# Altium schematic sheet Sheet1(Filter).SchDoc
size A; SheetNumber: 1; SheetTotal: 7
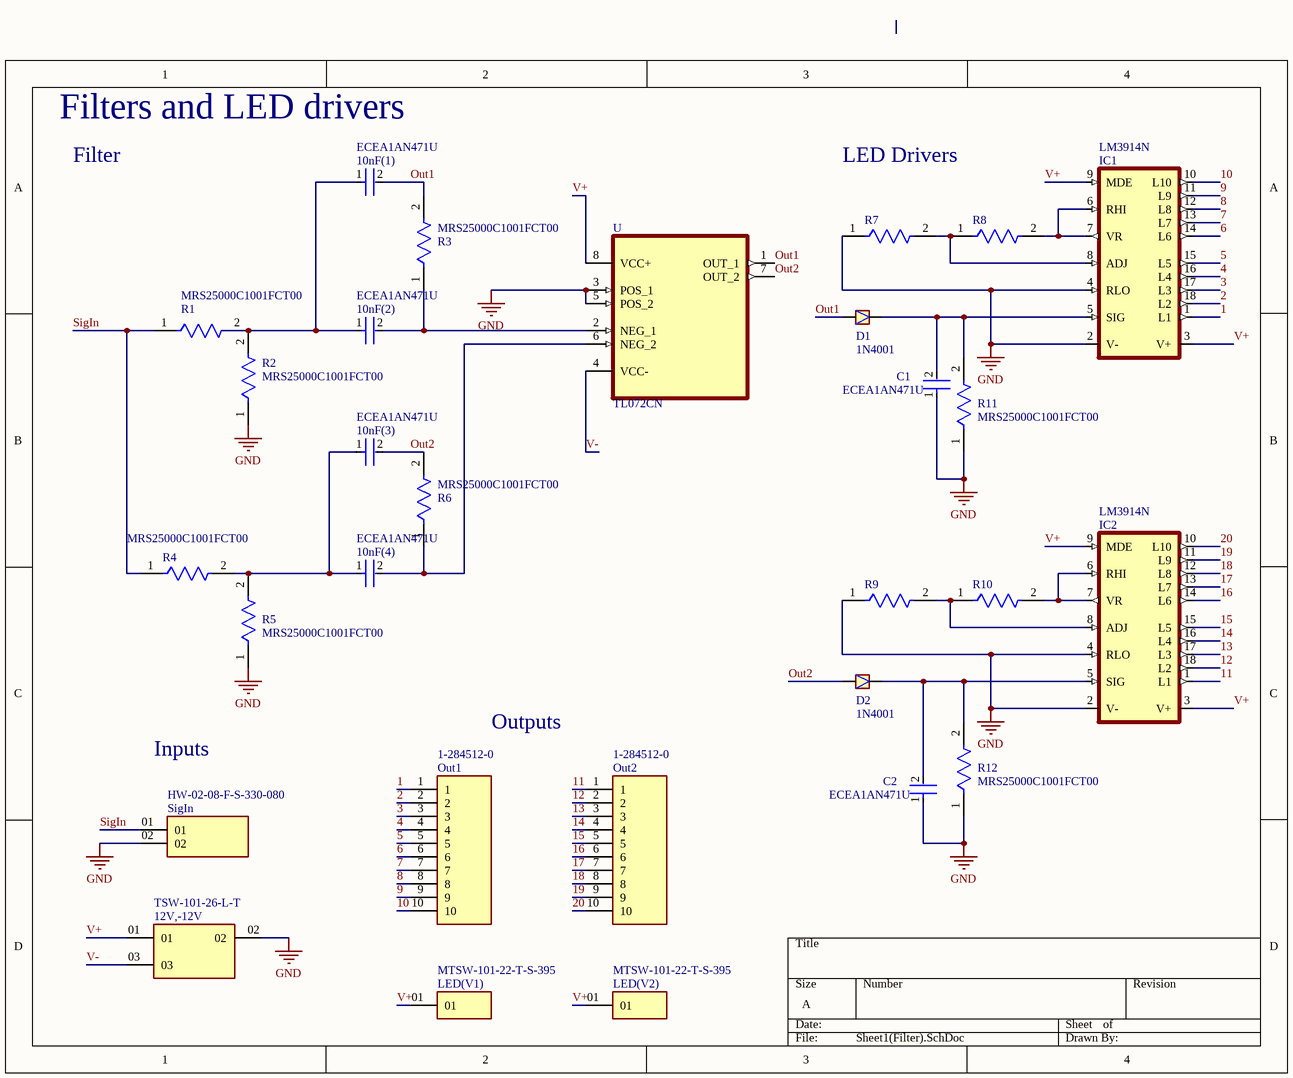
[diagram p0: Sheet1(Filter).SchDoc]

## Parts
10nF(1)  ECEA1AN471U  [FP-RAD-TH-D_10_0_5-L_16_1-MFG]
10nF(2)  ECEA1AN471U  [FP-RAD-TH-D_10_0_5-L_16_1-MFG]
10nF(3)  ECEA1AN471U  [FP-RAD-TH-D_10_0_5-L_16_1-MFG]
10nF(4)  ECEA1AN471U  [FP-RAD-TH-D_10_0_5-L_16_1-MFG]
12V,-12V  TSW-101-26-L-T  [SAMTEC_TSW-101-26-L-T]
C1  ECEA1AN471U  [FP-RAD-TH-D_10_0_5-L_16_1-MFG]
C2  ECEA1AN471U  [FP-RAD-TH-D_10_0_5-L_16_1-MFG]
D1  1N4001  [DO41-10]
D2  1N4001  [DO41-10]
IC1  LM3914N  [DIL18]
IC2  LM3914N  [DIL18]
LED(V1)  MTSW-101-22-T-S-395  [SAMTEC_MTSW-101-22-T-S-395]
LED(V2)  MTSW-101-22-T-S-395  [SAMTEC_MTSW-101-22-T-S-395]
Out1  1-284512-0  [TE_1-284512-0]
Out2  1-284512-0  [TE_1-284512-0]
R1  MRS25000C1001FCT00  [FP-MRS25-MFG]
R2  MRS25000C1001FCT00  [FP-MRS25-MFG]
R3  MRS25000C1001FCT00  [FP-MRS25-MFG]
R4  MRS25000C1001FCT00  [FP-MRS25-MFG]
R5  MRS25000C1001FCT00  [FP-MRS25-MFG]
R6  MRS25000C1001FCT00  [FP-MRS25-MFG]
R7  MRS25000C1001FCT00  [FP-MRS25-MFG]  (value not drawn)
R8  MRS25000C1001FCT00  [FP-MRS25-MFG]  (value not drawn)
R9  MRS25000C1001FCT00  [FP-MRS25-MFG]  (value not drawn)
R10  MRS25000C1001FCT00  [FP-MRS25-MFG]  (value not drawn)
R11  MRS25000C1001FCT00  [FP-MRS25-MFG]
R12  MRS25000C1001FCT00  [FP-MRS25-MFG]
SigIn  HW-02-08-F-S-330-080  [SAMTEC_HW-02-08-F-S-330-080]
U  TL072CN  [DIP254P762X533-8]

## Nets
GND: 12V,-12V.02 C1.1 C2.1 IC1.2(V-) IC1.4(RLO) IC2.2(V-) IC2.4(RLO) R2.1 R5.1 R7.1 R9.1 R11.1 R12.1 SigIn.02 U.3(POS_1) U.5(POS_2)
1: IC1.1(L1) Out1.1
2: IC1.18(L2) Out1.2
3: IC1.17(L3) Out1.3
4: IC1.16(L4) Out1.4
5: IC1.15(L5) Out1.5
6: IC1.14(L6) Out1.6
7: IC1.13(L7) Out1.7
8: IC1.12(L8) Out1.8
9: IC1.11(L9) Out1.9
10: IC1.10(L10) Out1.10
11: IC2.1(L1) Out2.1
12: IC2.18(L2) Out2.2
13: IC2.17(L3) Out2.3
14: IC2.16(L4) Out2.4
15: IC2.15(L5) Out2.5
16: IC2.14(L6) Out2.6
17: IC2.13(L7) Out2.7
18: IC2.12(L8) Out2.8
19: IC2.11(L9) Out2.9
20: IC2.10(L10) Out2.10
Out1: 10nF(1).2 D1.A(ANODE) R3.2 U.1(OUT_1)
Out2: 10nF(3).2 D2.A(ANODE) R6.2 U.7(OUT_2)
SigIn: R1.1 R4.1 SigIn.01
V+: 12V,-12V.01 IC1.3(V+) IC1.9(MDE) IC2.3(V+) IC2.9(MDE) LED(V1).01 LED(V2).01 U.8(VCC+)
V-: 12V,-12V.03 U.4(VCC-)
Net10nF(1)_1: 10nF(1).1 10nF(2).1 R1.2 R2.2
Net10nF(2)_2: 10nF(2).2 R3.1 U.2(NEG_1)
Net10nF(3)_1: 10nF(3).1 10nF(4).1 R4.2 R5.2
Net10nF(4)_2: 10nF(4).2 R6.1 U.6(NEG_2)
NetC1_2: C1.2 D1.C(CATHODE) IC1.5(SIG) R11.2
NetC2_2: C2.2 D2.C(CATHODE) IC2.5(SIG) R12.2
NetIC1_6: IC1.6(RHI) IC1.7(VR) R8.2
NetIC1_8: IC1.8(ADJ) R7.2 R8.1
NetIC2_6: IC2.6(RHI) IC2.7(VR) R10.2
NetIC2_8: IC2.8(ADJ) R9.2 R10.1

## Notes on the sheet
- Filters and LED drivers
- Filter
- LED Drivers
- Inputs
- Outputs

## Library data of the parts
10nF(1) 10nF(2) 10nF(3) 10nF(4) C1 C2 = CMP-05427-001928-1: Aluminum Electrolytic Capacitors (Radial Lead Type) 470uF ±20% 10V; Lead Diameter: 0.6mm; Dissipation Factor: 0.25%; Life (Hours): 2000Hour; Leakage Current: 3uA; Ripple Current: 340mA; Mount: Through Hole; REACH SVHC: No SVHC; Height: 16mm; Max Operating Temperature: 85°C; Case/Package: Radial; Packaging: Bulk; RoHS Compliant: Yes; Min Operating Temperature: -40°C; Termination: Radial; Height - Seated (Max): 0.63inch; Series: SU; Construction: RADIAL; Capacitance: 470uF; Tolerance: 20%; Radiation Hardening: No; Voltage Rating (DC): 10V; Lead Free: Lead Free; Diameter: 10mm; Lead Pitch: 5mm; Voltage Rating: 10V; Length: 16mm; Voltage: 10V; Package Quantity: 200
D1 D2 = 1N4001: <B>DIODE</B><p> general purpose rectifier, 1 A; MP: altium_native_batch; Package: None; Value: *; Availability: Unavailable; Price: None
IC1 IC2 = LM3914N: LED Lighting Drivers; MF: Texas Instruments; MP: LM3914N; Package: None; Price: None; Availability: Unavailable; Value: *; SnapEDA_Link: https://www.snapeda.com/parts/LM3914N/Texas%20Instruments/view-part/4652973/?ref=snap
LED(V1) LED(V2) = MTSW-101-22-T-S-395: Connector Header Through Hole 1 position; MF: Samtec; Package: None; Value: *; Check_prices: https://www.snapeda.com/parts/MTSW-101-22-T-S-395/Samtec/view-part/?ref=eda; SnapEDA_Link: https://www.snapeda.com/parts/MTSW-101-22-T-S-395/Samtec/view-part/?ref=snap; Availability: In Stock; Price: None; MP: MTSW-101-22-T-S-395; Purchase-URL: https://pricing.snapeda.com/search/part/MTSW-101-22-T-S-395/?ref=eda
Out1 Out2 = 1-284512-0: 10 POS TERMI-BLOK HDR 900 POLA; Number_of_Positions: 10; MF: TE Connectivity; Centerline_Pitch: 3.5 mm[.138 in]; Package: None; TE_purchase_URL: https://www.te.com/usa-en/product-1-284512-0.html?te_bu=Cor&te_type=disp&te_campaign=seda_glo_cor-seda-global-disp-prtnr-fy19-seda-model-bom-cta_sma-317_1&elqCampaignId=32493; Value: *; SnapEDA_Link: https://www.snapeda.com/parts/1-284512-0/TE%20Connectivity%20AMP%20Connectors/view-part/2366032/?ref=snap; Price: None; MP: 1-284512-0; Availability: Unavailable; EU_RoHS_Compliance: Compliant
R1-R12 = CMP-02408-000051-1: RES 1K OHM 0.6W 1% AXIAL; Power Rating: 600mW; Lead Diameter: 0.6mm; Voltage Rating (DC): 350V; Resistance: 1kR; Temperature Coefficient: 50ppm/°C; Width: 2.5mm; Military Standard: Not; Package Quantity: 5000; Radiation Hardening: No; Case/Package: Axial; Resistance Tolerance: 1%; Resistor Type: Metal Film; Contact Plating: Tin; Length: 6.5mm; Lead Free: Lead Free; RoHS Compliant: Yes; Mount: Through Hole; Number of Pins: 2; Technology: THIN FILM; Voltage Rating: 350V; Min Operating Temperature: -55°C; Weight: 0.00776oz; Diameter: 2.5mm; Construction: Cylindrical; Series: MRS25; Tolerance: 1%; Packaging: Tape and Reel; Max Operating Temperature: 155°C; Max Power Dissipation: 600mW; Number of Terminations: 2; Termination: Axial
U = TL072CN: J-FET Amplifier 2 Circuit 8-DIP; MF: Texas Instruments; Price: None; Package: DIP-8 Texas Instruments; MP: TL072CN; Value: *; Availability: Unavailable; SnapEDA_Link: https://www.snapeda.com/parts/TL072CN/Texas%20Instruments/view-part/576842/?ref=snap
12V,-12V = TSW-101-26-L-T: Package: None; Price: None; Value: *; MP: TSW-101-26-L-T; Availability: Unavailable
SigIn = HW-02-08-F-S-330-080: Availability: Unavailable; Price: None; Package: None; MP: HW-02-08-F-S-330-080; Value: *